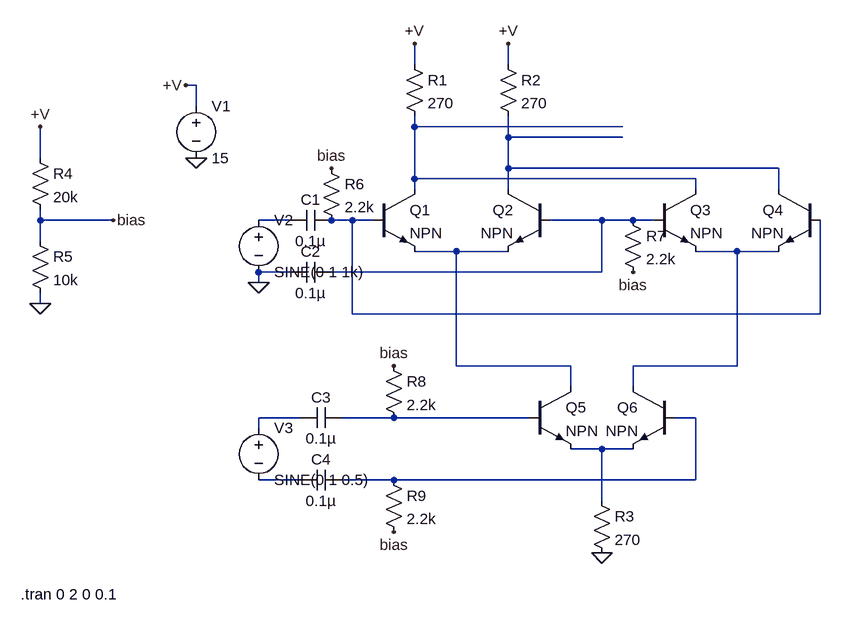
[diagram p0: schematic Gilbert Cell envelope.asc]
Gilbert Cell envelope.asc, the LTspice schematic file:
Version 4
SHEET 1 880 752
WIRE 128 -80 128 -112
WIRE 272 -80 272 -112
WIRE -208 -48 -224 -48
WIRE -208 -16 -208 -48
WIRE 128 16 128 0
WIRE 448 16 128 16
WIRE 272 32 272 0
WIRE 448 32 272 32
WIRE -448 64 -448 16
WIRE 272 80 272 32
WIRE 688 80 272 80
WIRE 128 96 128 16
WIRE 560 96 128 96
WIRE 128 112 128 96
WIRE 272 112 272 80
WIRE 560 112 560 96
WIRE 688 112 688 80
WIRE -448 160 -448 144
WIRE -336 160 -448 160
WIRE -64 160 -112 160
WIRE 32 160 0 160
WIRE 64 160 32 160
WIRE 416 160 336 160
WIRE 464 160 416 160
WIRE 496 160 464 160
WIRE -448 192 -448 160
WIRE 192 208 128 208
WIRE 272 208 192 208
WIRE 624 208 560 208
WIRE 688 208 624 208
WIRE -64 240 -112 240
WIRE 416 240 416 160
WIRE 416 240 0 240
WIRE -112 256 -112 240
WIRE -448 288 -448 272
WIRE 32 304 32 160
WIRE 752 304 752 160
WIRE 752 304 32 304
WIRE 192 384 192 208
WIRE 368 384 192 384
WIRE 624 384 624 208
WIRE 624 384 464 384
WIRE 368 416 368 384
WIRE 464 416 464 384
WIRE -48 464 -112 464
WIRE 96 464 16 464
WIRE 304 464 96 464
WIRE 560 464 528 464
WIRE -112 480 -112 464
WIRE 416 512 368 512
WIRE 464 512 416 512
WIRE -48 560 -112 560
WIRE 96 560 16 560
WIRE 560 560 560 464
WIRE 560 560 96 560
WIRE 416 592 416 512
FLAG -208 64 0
FLAG -224 -48 +V
FLAG 128 -112 +V
FLAG 272 -112 +V
FLAG 416 672 0
FLAG -448 16 +V
FLAG -448 288 0
FLAG -336 160 bias
FLAG 0 80 bias
FLAG 464 240 bias
FLAG 96 384 bias
FLAG 96 640 bias
FLAG -112 256 0
SYMBOL npn 64 112 R0
SYMATTR InstName Q1
SYMBOL npn 336 112 M0
SYMATTR InstName Q2
SYMBOL npn 496 112 R0
SYMATTR InstName Q3
SYMBOL npn 752 112 M0
SYMATTR InstName Q4
SYMBOL res 112 -96 R0
SYMATTR InstName R1
SYMATTR Value 270
SYMBOL res 256 -96 R0
SYMATTR InstName R2
SYMATTR Value 270
SYMBOL voltage -208 -32 R0
WINDOW 123 0 0 Left 0
WINDOW 39 0 0 Left 0
SYMATTR InstName V1
SYMATTR Value 15
SYMBOL npn 304 416 R0
SYMATTR InstName Q5
SYMBOL npn 528 416 M0
SYMATTR InstName Q6
SYMBOL res 400 576 R0
SYMATTR InstName R3
SYMATTR Value 270
SYMBOL voltage -112 144 R0
WINDOW 123 0 0 Left 0
WINDOW 39 0 0 Left 0
SYMATTR InstName V2
SYMATTR Value SINE(0 1 1k)
SYMBOL voltage -112 464 R0
WINDOW 123 0 0 Left 0
WINDOW 39 0 0 Left 0
SYMATTR InstName V3
SYMATTR Value SINE(0 1 0.5)
SYMBOL res -464 48 R0
SYMATTR InstName R4
SYMATTR Value 20k
SYMBOL res -464 176 R0
SYMATTR InstName R5
SYMATTR Value 10k
SYMBOL cap 0 144 R90
WINDOW 0 0 32 VBottom 2
WINDOW 3 32 32 VTop 2
SYMATTR InstName C1
SYMATTR Value 0.1µ
SYMBOL cap 0 224 R90
WINDOW 0 0 32 VBottom 2
WINDOW 3 32 32 VTop 2
SYMATTR InstName C2
SYMATTR Value 0.1µ
SYMBOL cap 16 448 R90
WINDOW 0 0 32 VBottom 2
WINDOW 3 32 32 VTop 2
SYMATTR InstName C3
SYMATTR Value 0.1µ
SYMBOL cap 16 544 R90
WINDOW 0 0 32 VBottom 2
WINDOW 3 32 32 VTop 2
SYMATTR InstName C4
SYMATTR Value 0.1µ
SYMBOL res -16 64 R0
SYMATTR InstName R6
SYMATTR Value 2.2k
SYMBOL res 448 144 R0
SYMATTR InstName R7
SYMATTR Value 2.2k
SYMBOL res 80 368 R0
SYMATTR InstName R8
SYMATTR Value 2.2k
SYMBOL res 80 544 R0
SYMATTR InstName R9
SYMATTR Value 2.2k
TEXT -478 736 Left 2 !.tran 0 2 0 0.1

The netlist it stands for:
* Gilbert Cell envelope.asc
Q1 N001 N004 N006 0 NPN
Q2 N002 N005 N006 0 NPN
Q3 N001 N005 N007 0 NPN
Q4 N002 N004 N007 0 NPN
R1 +V N001 270
R2 +V N002 270
V1 +V 0 15
Q5 N006 N009 N011 0 NPN
Q6 N007 N010 N011 0 NPN
R3 N011 0 270
V2 N003 0 SINE(0 1 1k)
V3 N008 N012 SINE(0 1 0.5)
R4 +V bias 20k
R5 bias 0 10k
C1 N004 N003 0.1µ
C2 N005 0 0.1µ
C3 N009 N008 0.1µ
C4 N010 N012 0.1µ
R6 bias N004 2.2k
R7 N005 bias 2.2k
R8 bias N009 2.2k
R9 N010 bias 2.2k
.model NPN NPN
.model PNP PNP
.lib standard.bjt
.tran 0 2 0 0.1
.backanno
.end